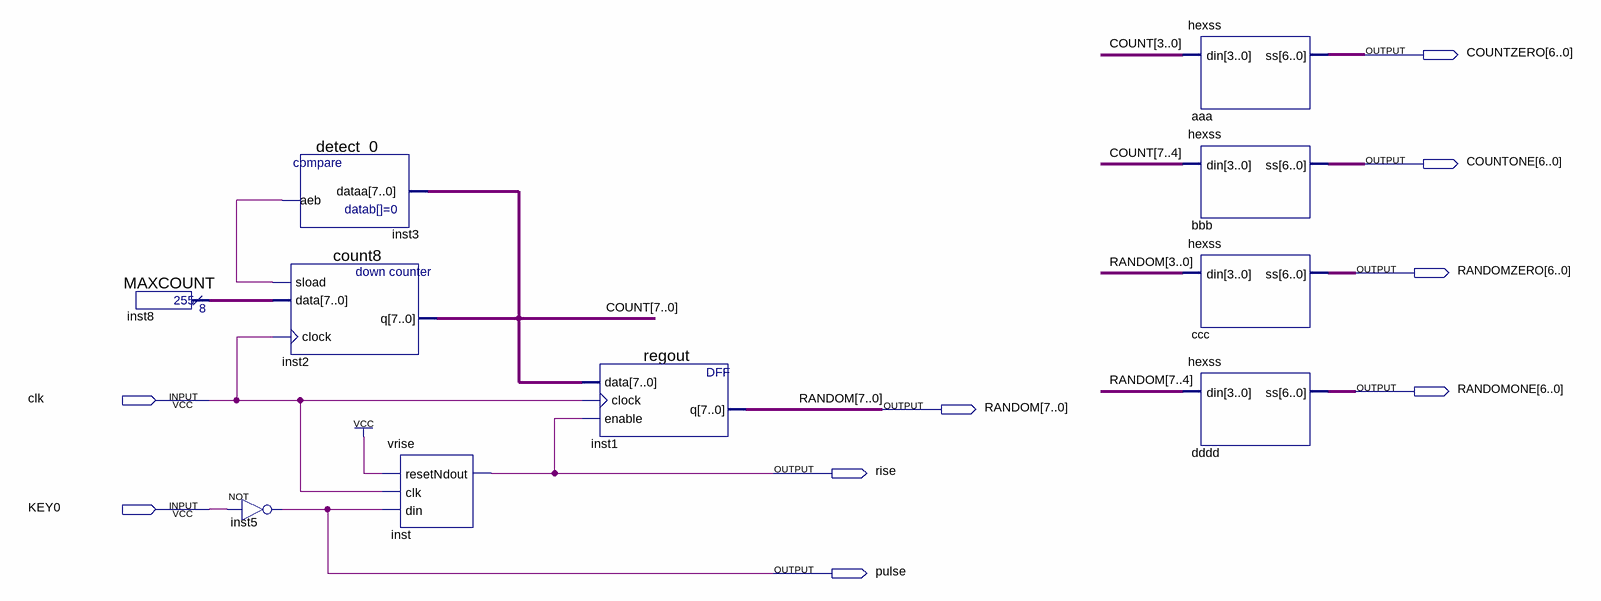
[diagram p0: schematic sheet]
// Quartus schematic hw_debug.bdf as structural Verilog: 10 symbols, 9 pins
module hw_debug (
  input  clk,
  input  KEY0,
  output [6:0] COUNTZERO,
  output [6:0] COUNTONE,
  output [6:0] RANDOMZERO,
  output [6:0] RANDOMONE,
  output [7:0] RANDOM,
  output rise,
  output pulse
);

  wire inst3_aeb;
  wire [7:0] COUNT, inst8_result;

  MAXCOUNT inst8 (.result(inst8_result));
  detect_0 inst3 (.dataa(COUNT), .aeb(inst3_aeb));
  count8 inst2 (.sload(inst3_aeb), .data(inst8_result), .clock(clk), .q(COUNT));
  not inst5 (pulse, KEY0);
  vrise inst (.resetN(1'b1), .clk(clk), .din(pulse), .dout(rise));
  regout inst1 (.data(COUNT), .clock(clk), .enable(rise), .q(RANDOM));
  hexss aaa (.din(COUNT[3:0]), .ss(COUNTZERO));
  hexss bbb (.din(COUNT[7:4]), .ss(COUNTONE));
  hexss ccc (.din(RANDOM[3:0]), .ss(RANDOMZERO));
  hexss dddd (.din(RANDOM[7:4]), .ss(RANDOMONE));
endmodule
